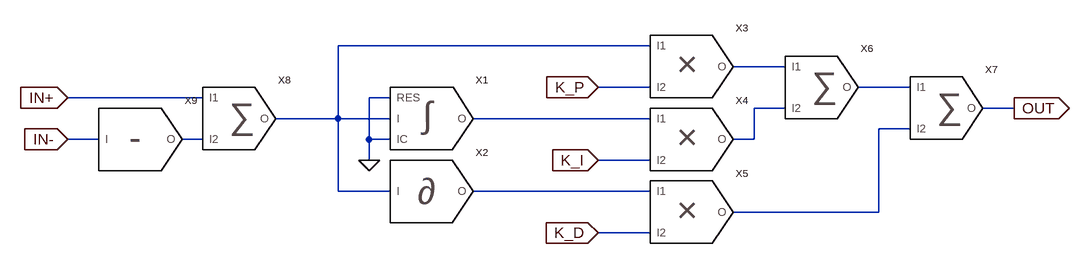
[diagram p0: schematic PID_Diff.asc]
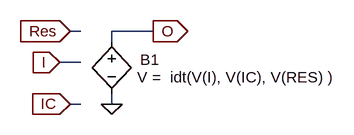
[diagram p1: sub-circuit integrator_module.asc]
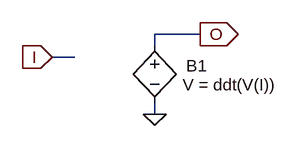
[diagram p2: sub-circuit derivator_module.asc]
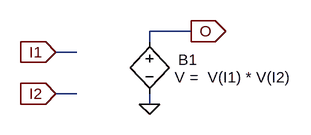
[diagram p3: sub-circuit multiplier_module.asc]
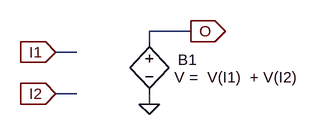
[diagram p4: sub-circuit sum_module.asc]
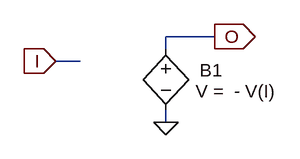
[diagram p5: sub-circuit neg_module.asc]
PID_Diff.asc, the LTspice schematic file:
Version 4
SHEET 1 2124 680
WIRE 1456 112 976 112
WIRE 1664 144 1584 144
WIRE 1456 176 1376 176
WIRE 1856 176 1776 176
WIRE 768 192 560 192
WIRE 1056 192 1024 192
WIRE 1664 208 1616 208
WIRE 2016 208 1968 208
WIRE 976 224 976 112
WIRE 976 224 880 224
WIRE 1056 224 976 224
WIRE 1456 224 1184 224
WIRE 1856 240 1808 240
WIRE 608 256 560 256
WIRE 768 256 736 256
WIRE 1024 256 1024 192
WIRE 1056 256 1024 256
WIRE 1616 256 1616 208
WIRE 1616 256 1584 256
WIRE 1024 288 1024 256
WIRE 1456 288 1376 288
WIRE 976 336 976 224
WIRE 1056 336 976 336
WIRE 1456 336 1184 336
WIRE 1808 368 1808 240
WIRE 1808 368 1584 368
WIRE 1456 400 1376 400
FLAG 2016 208 OUT
IOPIN 2016 208 Out
FLAG 1376 176 K_P
IOPIN 1376 176 In
FLAG 1376 288 K_I
IOPIN 1376 288 In
FLAG 1376 400 K_D
IOPIN 1376 400 In
FLAG 1024 288 0
FLAG 560 192 IN+
IOPIN 560 192 In
FLAG 560 256 IN-
IOPIN 560 256 In
SYMBOL integrator_module 1200 208 R0
SYMATTR InstName X1
SYMBOL derivator_module 1152 320 R0
SYMATTR InstName X2
SYMATTR SpiceLine k=0
SYMBOL multiplier_module 1552 128 R0
SYMATTR InstName X3
SYMBOL multiplier_module 1552 240 R0
SYMATTR InstName X4
SYMBOL multiplier_module 1552 352 R0
SYMATTR InstName X5
SYMBOL sum_module 1744 160 R0
SYMATTR InstName X6
SYMBOL sum_module 1936 192 R0
SYMATTR InstName X7
SYMBOL sum_module 848 208 R0
SYMATTR InstName X8
SYMBOL neg_module 704 240 R0
SYMATTR InstName X9

integrator_module.asc, the sub-circuit schematic file:
Version 4
SHEET 1 880 680
WIRE 128 160 112 160
WIRE 240 160 176 160
WIRE 176 176 176 160
WIRE 128 208 96 208
WIRE 128 272 112 272
WIRE 176 272 176 256
FLAG 96 208 I
IOPIN 96 208 In
FLAG 176 272 0
FLAG 240 160 O
IOPIN 240 160 Out
FLAG 112 272 IC
IOPIN 112 272 In
FLAG 112 160 Res
IOPIN 112 160 In
SYMBOL bv 176 160 R0
WINDOW 0 44 44 Left 0
WINDOW 3 39 71 Left 0
SYMATTR InstName B1
SYMATTR Value V =  idt(V(I), V(IC), V(RES) )

derivator_module.asc, the sub-circuit schematic file:
Version 4
SHEET 1 880 680
WIRE 240 160 176 160
WIRE 176 176 176 160
WIRE 64 192 32 192
WIRE 176 272 176 256
FLAG 32 192 I
IOPIN 32 192 In
FLAG 176 272 0
FLAG 240 160 O
IOPIN 240 160 Out
SYMBOL bv 176 160 R0
WINDOW 0 44 44 Left 0
WINDOW 3 39 71 Left 0
SYMATTR InstName B1
SYMATTR Value V = ddt(V(I))

multiplier_module.asc, the sub-circuit schematic file:
Version 4
SHEET 1 880 680
WIRE 240 160 176 160
WIRE 176 176 176 160
WIRE 64 192 32 192
WIRE 64 256 32 256
WIRE 176 272 176 256
FLAG 32 192 I1
IOPIN 32 192 In
FLAG 32 256 I2
IOPIN 32 256 In
FLAG 176 272 0
FLAG 240 160 O
IOPIN 240 160 Out
SYMBOL bv 176 160 R0
WINDOW 0 44 44 Left 0
WINDOW 3 39 71 Left 0
SYMATTR InstName B1
SYMATTR Value V =  V(I1) * V(I2)

sum_module.asc, the sub-circuit schematic file:
Version 4
SHEET 1 880 680
WIRE 240 160 176 160
WIRE 176 176 176 160
WIRE 64 192 32 192
WIRE 64 256 32 256
WIRE 176 272 176 256
FLAG 32 192 I1
IOPIN 32 192 In
FLAG 32 256 I2
IOPIN 32 256 In
FLAG 176 272 0
FLAG 240 160 O
IOPIN 240 160 Out
SYMBOL bv 176 160 R0
WINDOW 0 44 44 Left 0
WINDOW 3 39 71 Left 0
SYMATTR InstName B1
SYMATTR Value V =  V(I1)  + V(I2)

neg_module.asc, the sub-circuit schematic file:
Version 4
SHEET 1 880 680
WIRE 240 160 176 160
WIRE 176 176 176 160
WIRE 64 192 32 192
WIRE 176 272 176 256
FLAG 32 192 I
IOPIN 32 192 In
FLAG 176 272 0
FLAG 240 160 O
IOPIN 240 160 Out
SYMBOL bv 176 160 R0
WINDOW 0 44 44 Left 0
WINDOW 3 39 71 Left 0
SYMATTR InstName B1
SYMATTR Value V =  - V(I)

The netlist it stands for:
* PID_Diff.asc
XX1 N005 N001 0 0 integrator_module
XX2 N008 N001 derivator_module params: k=0
XX3 N002 N001 K_P multiplier_module
XX4 N004 N005 K_I multiplier_module
XX5 N006 N008 K_D multiplier_module
XX6 N003 N002 N004 sum_module
XX7 OUT N003 N006 sum_module
XX8 N001 IN+ N007 sum_module
XX9 N007 IN- neg_module

* block symbol definitions
.subckt integrator_module O I IC RES
B1 O 0 V =  idt(V(I), V(IC), V(RES) )
.ends integrator_module

.subckt derivator_module O I
B1 O 0 V = ddt(V(I))
.ends derivator_module

.subckt multiplier_module O I1 I2
B1 O 0 V =  V(I1) * V(I2)
.ends multiplier_module

.subckt sum_module O I1 I2
B1 O 0 V =  V(I1)  + V(I2)
.ends sum_module

.subckt neg_module O I
B1 O 0 V =  - V(I)
.ends neg_module

.backanno
.end